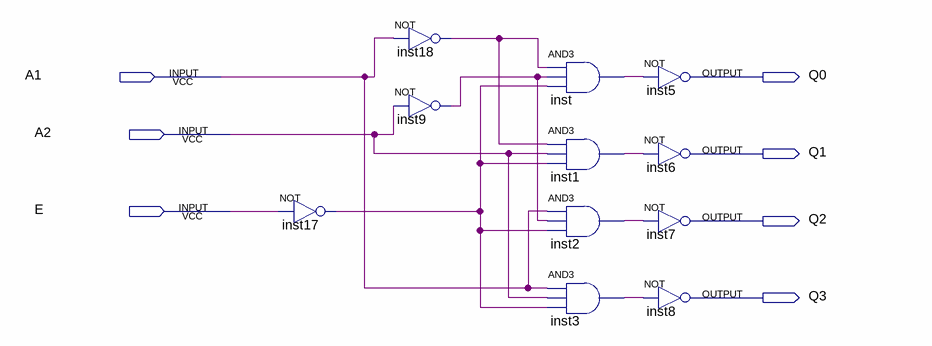
[diagram p0: schematic sheet]
// Quartus schematic Title_3.bdf as structural Verilog: 11 symbols, 7 pins
module Title_3 (
  input  A1,
  input  A2,
  input  E,
  output Q0,
  output Q1,
  output Q2,
  output Q3
);

  wire inst1_out, inst2_out, inst3_out, inst9_out, inst17_out, inst18_out, inst_out;

  not inst17 (inst17_out, E);
  not inst18 (inst18_out, A1);
  not inst9 (inst9_out, A2);
  and inst (inst_out, inst18_out, inst9_out, inst17_out);
  and inst1 (inst1_out, inst18_out, A2, inst17_out);
  and inst2 (inst2_out, A1, inst9_out, inst17_out);
  and inst3 (inst3_out, A1, A2, inst17_out);
  not inst5 (Q0, inst_out);
  not inst6 (Q1, inst1_out);
  not inst7 (Q2, inst2_out);
  not inst8 (Q3, inst3_out);
endmodule
